# EAGLE design samtec to dsub (EAGLE 7.2.0)
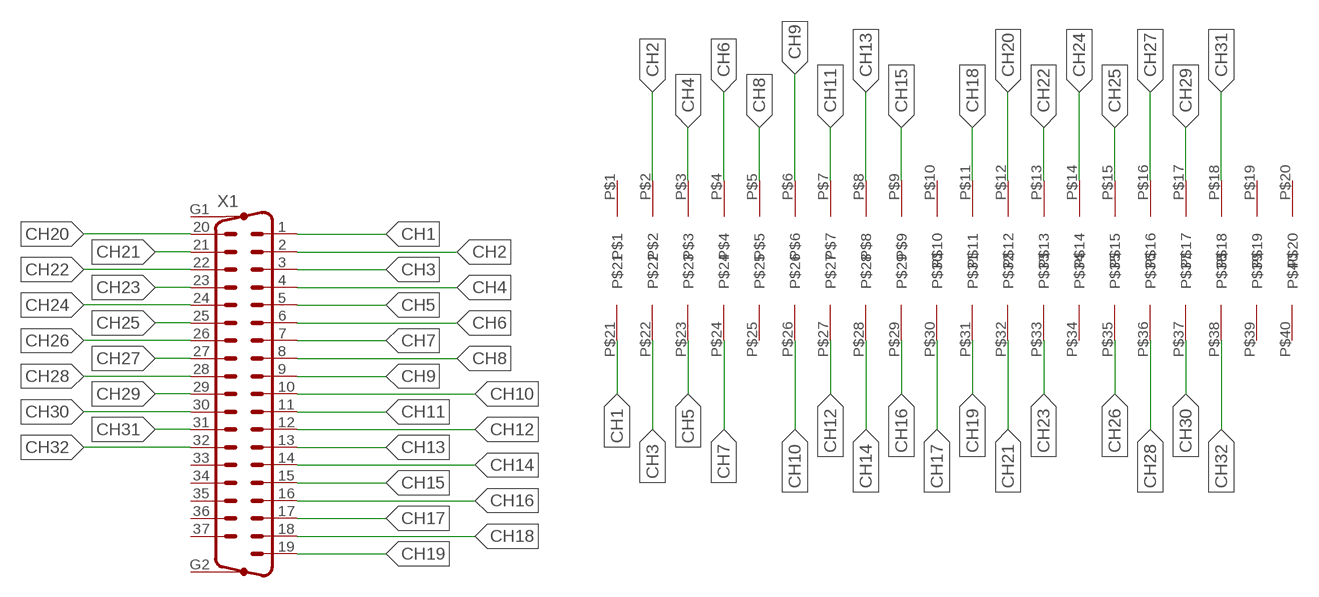
[diagram p0: schematic, sheet 1]

## Parts
U$1  SAMTEC_FTSH_LARGEPAD  [SAMTEC-FTSH-LARGEPAD]
X1  M37HP  [M37HP]

## Nets
CH1: U$1.P$21 X1.1
CH2: U$1.P$2 X1.2
CH3: U$1.P$22 X1.3
CH4: U$1.P$3 X1.4
CH5: U$1.P$23 X1.5
CH6: U$1.P$4 X1.6
CH7: U$1.P$24 X1.7
CH8: U$1.P$5 X1.8
CH9: U$1.P$6 X1.9
CH10: U$1.P$26 X1.10
CH11: U$1.P$7 X1.11
CH12: U$1.P$27 X1.12
CH13: U$1.P$8 X1.13
CH14: U$1.P$28 X1.14
CH15: U$1.P$9 X1.15
CH16: U$1.P$29 X1.16
CH17: U$1.P$30 X1.17
CH18: U$1.P$11 X1.18
CH19: U$1.P$31 X1.19
CH20: U$1.P$12 X1.20
CH21: U$1.P$32 X1.21
CH22: U$1.P$13 X1.22
CH23: U$1.P$33 X1.23
CH24: U$1.P$14 X1.24
CH25: U$1.P$15 X1.25
CH26: U$1.P$35 X1.26
CH27: U$1.P$16 X1.27
CH28: U$1.P$36 X1.28
CH29: U$1.P$17 X1.29
CH30: U$1.P$37 X1.30
CH31: U$1.P$18 X1.31
CH32: U$1.P$38 X1.32
Unconnected: U$1.P$1 U$1.P$10 U$1.P$19 U$1.P$20 U$1.P$25 U$1.P$34 U$1.P$39 U$1.P$40 X1.33 X1.34 X1.35 X1.36 X1.37 X1.G1 X1.G2

## Library data of the parts
U$1 = mayo:SAMTEC_FTSH_LARGEPAD
X1 = con-subd:M37HP: SUB-D; OC_FARNELL: unknown; OC_NEWARK: unknown

## Board
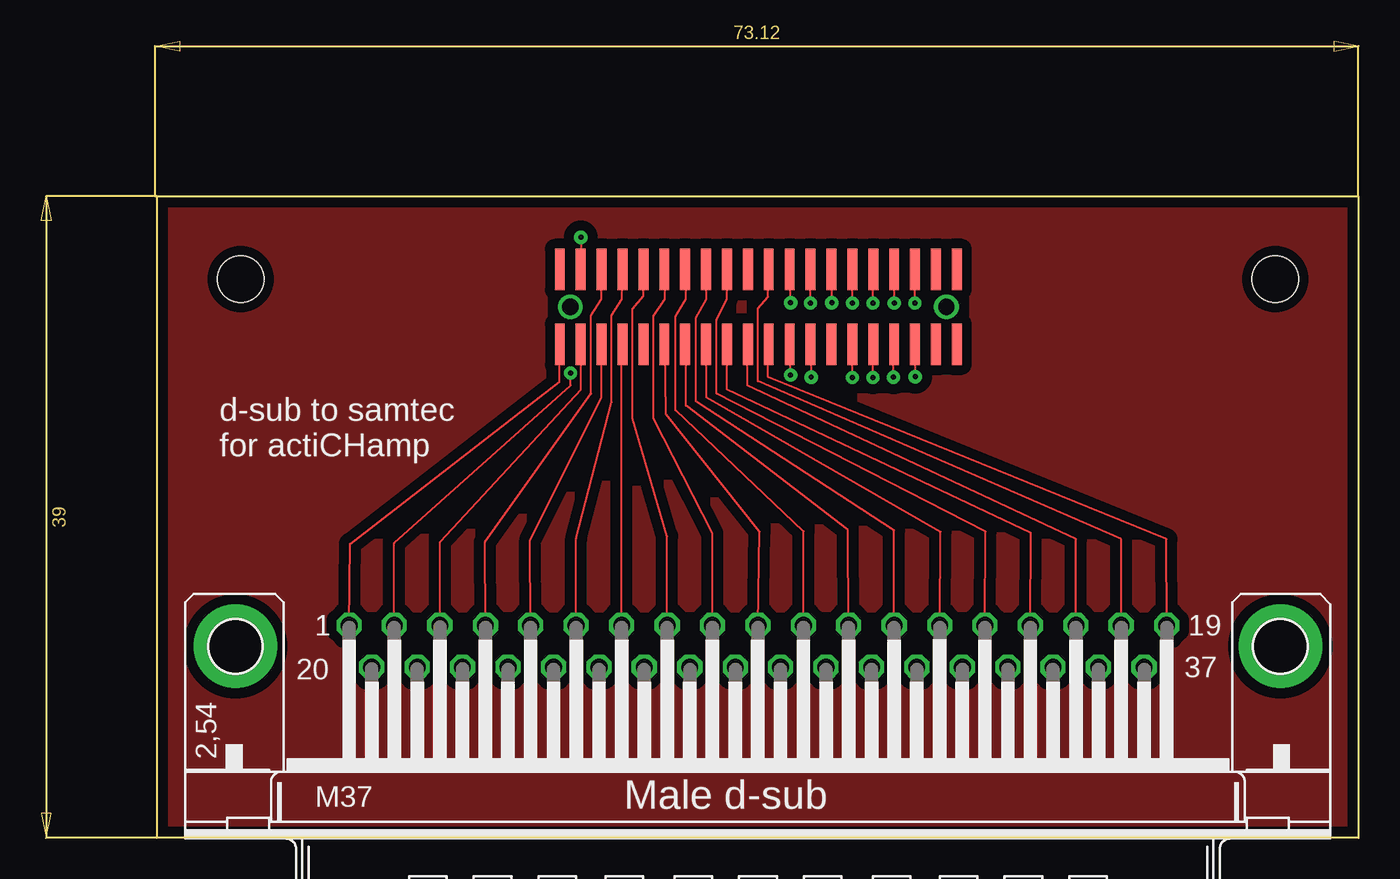
[diagram p1: board, top side]
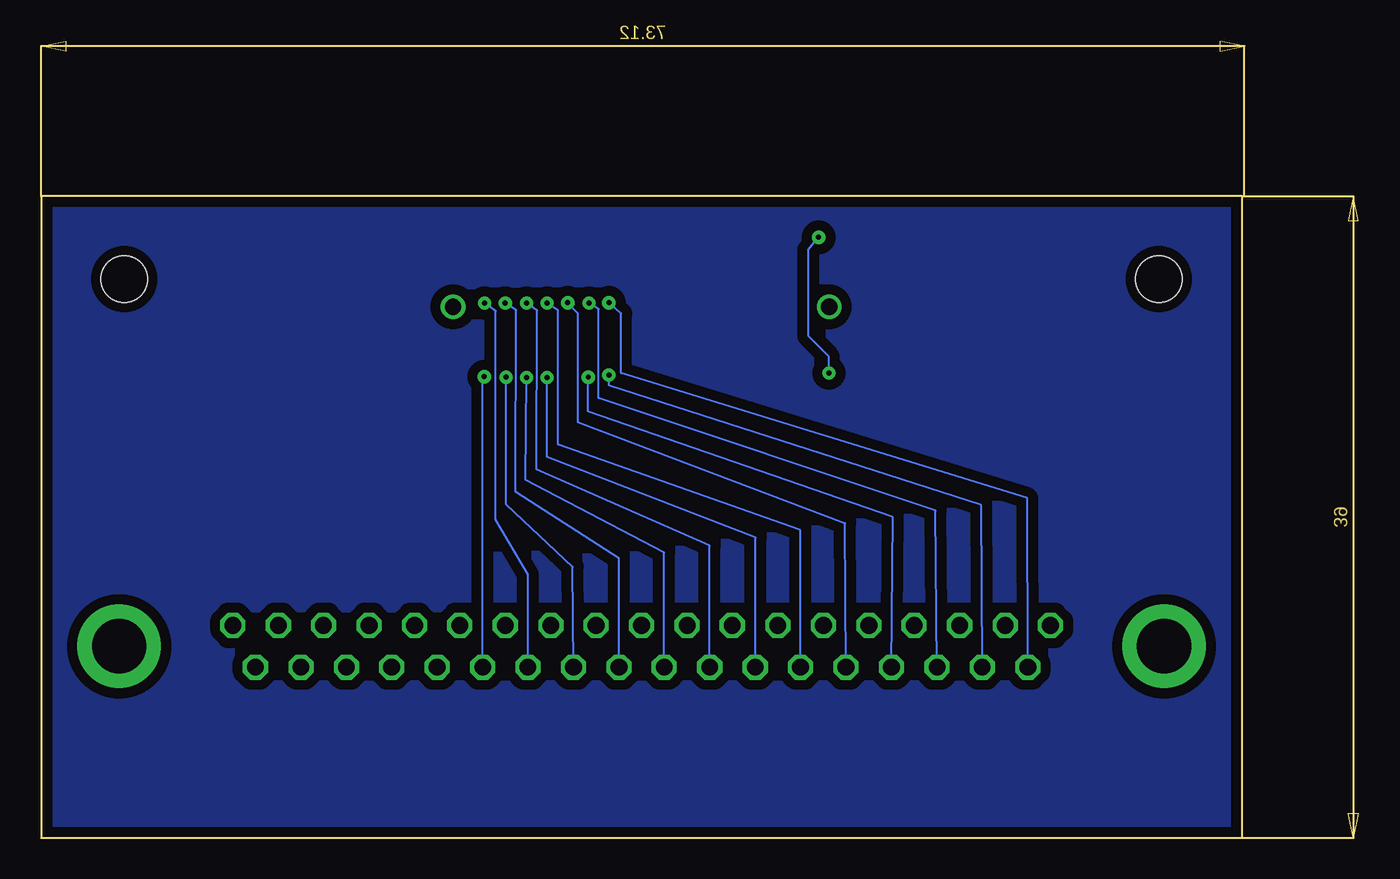
[diagram p2: board, bottom side, seen from below]

Size 73 x 39 mm. Coordinates in mm from the lower left corner, seen from the top.
Outline: 0,0 0,39 73,39 73,0 0,0
Copper layers (1*16): Top 0.035mm / dielectric 1.5mm / Bottom 0.035mm
Design rules "pcbtrain *": minimum track width 5mil, minimum drill 0.3mm, track to track 5mil, track to pad 5mil, pad to pad 5mil, via to via 5mil, smd to smd 0mil, copper to edge 0.25mm, drill to drill 0.2mm, minimum pad ring 10mil, minimum via ring 10mil, stop-mask expansion 5mil, vias tented up to drill 0mil, thermal gap 10mil
Holes 2.8 mm at 5.07,33.95 67.95,33.96

### Footprints (pad centres in the part's own frame; a part is rotated, then mirrored left to right if it is on the bottom)
SAMTEC-FTSH-LARGEPAD = smd 0.6 x 2.5: P$1 -23,7; P$2 -21.73,7; P$3 -20.46,7; P$4 -19.19,7; P$5 -17.92,7; P$6 -16.65,7; P$7 -15.38,7; P$8 -14.11,7; P$9 -12.84,7; P$10 -11.57,7; P$11 -10.3,7; P$12 -9.03,7; P$13 -7.76,7; P$14 -6.49,7; P$15 -5.22,7; P$16 -3.95,7; P$17 -2.68,7; P$18 -1.41,7; P$19 -0.14,7; P$20 1.13,7; P$21 -23,2.45; P$22 -21.73,2.45; P$23 -20.46,2.45; P$24 -19.19,2.45; P$25 -17.92,2.45; P$26 -16.65,2.45; P$27 -15.38,2.45; P$28 -14.11,2.45; P$29 -12.84,2.45; P$30 -11.57,2.45; P$31 -10.3,2.45; P$32 -9.03,2.45; P$33 -7.76,2.45; P$34 -6.49,2.45; P$35 -5.22,2.45; P$36 -3.95,2.45; P$37 -2.68,2.45; P$38 -1.41,2.45; P$39 -0.14,2.45; P$40 1.13,2.45 | drill 1: P$41 -22.365,4.725; P$42 0.495,4.725
M37HP = drill 1.016 octagon: 1 -24.841,1.27; 2 -22.098,1.27; 3 -19.329,1.27; 4 -16.561,1.27; 5 -13.818,1.27; 6 -11.049,1.27; 7 -8.28,1.27; 8 -5.512,1.27; 9 -2.769,1.27; 10 0,1.27; 11 2.769,1.27; 12 5.512,1.27; 13 8.28,1.27; 14 11.049,1.27; 15 13.792,1.27; 16 16.561,1.27; 17 19.329,1.27; 18 22.073,1.27; 19 24.841,1.27; 20 -23.47,-1.27; 21 -20.701,-1.27; 22 -17.958,-1.27; 23 -15.189,-1.27; 24 -12.421,-1.27; 25 -9.652,-1.27; 26 -6.909,-1.27; 27 -4.14,-1.27; 28 -1.372,-1.27; 29 1.372,-1.27; 30 4.14,-1.27; 31 6.909,-1.27; 32 9.652,-1.27; 33 12.421,-1.27; 34 15.189,-1.27; 35 17.932,-1.27; 36 20.701,-1.27; 37 23.47,-1.27 | drill 3.302 pad 5.08: G1 -31.75,0; G2 31.75,0

### Placement (x,y rotation side)
U$1  47.47,27.55 0 top
X1  36.51,11.64 0 top

### Tracks (layer width: path | path; a pad name or v marks a point on that pad's centre or on a via)
CH1
  Top 0.127: X1.1 11.72,17.87 24.45,27.73 24.45,29.98 U$1.P$21
CH2  (via drill 0.3)
  Top 0.127: X1.2 14.41,17.91 25.12,27.5 v25.12,28.25 | v25.75,36.5 U$1.P$2
  Bottom 0.127: v25.12,28.25 25.12,29.25 26.38,30.5 26.38,35.75 v25.75,36.5
CH3
  Top 0.127: X1.3 17.18,17.98 25.75,27.25 U$1.P$22
CH4
  Top 0.127: X1.4 19.92,17.97 26.38,27 26.38,31.75 27,32.75 U$1.P$3
CH5
  Top 0.127: X1.5 22.67,18.12 27,26.75 U$1.P$23
CH6
  Top 0.127: X1.6 25.46,18.19 27.62,26.48 27.62,31.75 28.25,32.75 28.25,34.52 U$1.P$4
CH7
  Top 0.127: X1.7 28.23,29.95 U$1.P$24
CH8
  Top 0.127: X1.8 31,18.33 28.88,25.48 28.88,32.12 29.55,32.92 U$1.P$5
CH9
  Top 0.127: X1.9 33.74,18.51 30.17,25.48 30.17,31.73 30.85,32.75 30.85,34.38 U$1.P$6
CH10
  Top 0.127: X1.10 36.61,18.62 30.92,25.75 30.85,29.97 U$1.P$26
CH11
  Top 0.127: X1.11 39.28,18.62 31.5,26 31.5,31.67 32.12,32.75 32.12,34.52 U$1.P$7
CH12
  Top 0.127: X1.12 41.97,18.7 32.12,26.27 32.12,30.03 U$1.P$27
CH13
  Top 0.127: X1.13 44.79,18.69 32.75,26.52 32.75,31.62 33.38,32.75 33.38,34.53 U$1.P$8
CH14
  Top 0.127: X1.14 47.61,18.59 33.38,26.77 33.38,29.98 U$1.P$28
CH15
  Top 0.127: X1.15 50.34,18.61 34,27 34,31.5 34.62,32.75 U$1.P$9
CH16
  Top 0.127: X1.16 53.09,18.53 34.62,27.25 U$1.P$29
CH17
  Top 0.127: X1.17 55.84,18.16 35.88,27.5 35.88,29.98 U$1.P$30
CH18
  Top 0.127: X1.18 58.59,18.16 36.5,27.75 36.5,32.17 37.12,32.88 37.12,34.51 U$1.P$11
CH19
  Top 0.127: X1.19 61.34,18.16 37.12,28 37.12,29.95 U$1.P$31
CH20  (via drill 0.3)
  Top 0.127: 38.38,34.48 U$1.P$12 38.5,34.49 v38.5,32.52
  Bottom 0.127: X1.20 13.07,20.65 37.75,28.25 37.75,31.88 v38.5,32.52
CH21  (via drill 0.3)
  Top 0.127: v38.5,28.12 38.5,29.94 U$1.P$32
  Bottom 0.127: X1.21 15.87,20.22 38.5,27.5 v38.5,28.12
CH22  (via drill 0.3)
  Top 0.127: v39.7,32.5 U$1.P$13
  Bottom 0.127: X1.22 18.65,19.9 39.12,26.73 39.12,32.12 v39.7,32.5
CH23  (via drill 0.3)
  Top 0.127: v39.75,28 39.75,29.96 U$1.P$33
  Bottom 0.127: X1.23 21.24,19.49 39.75,25.92 v39.75,28
CH24  (via drill 0.3)
  Top 0.127: v41,32.52 41,34.53 U$1.P$14
  Bottom 0.127: X1.24 24.15,19.12 40.38,25.25 40.38,31.88 v41,32.52
CH25  (via drill 0.3)
  Top 0.127: v42.25,32.5 U$1.P$15
  Bottom 0.127: X1.25 26.86,18.71 41.58,23.9 41.6,32.05 v42.25,32.5
CH26  (via drill 0.3)
  Top 0.127: v42.25,27.98 U$1.P$35
  Bottom 0.127: X1.26 29.58,18.25 42.25,23.15 v42.25,27.98
CH27  (via drill 0.3)
  Top 0.127: v43.5,32.5 43.5,34.53 U$1.P$16
  Bottom 0.127: X1.27 32.37,17.77 42.9,22.4 42.85,32.05 v43.5,32.5
CH28  (via drill 0.3)
  Top 0.127: v43.5,27.98 43.5,29.98 U$1.P$36
  Bottom 0.127: X1.28 35.14,17.34 43.55,21.75 v43.5,27.98
CH29  (via drill 0.3)
  Top 0.127: v44.8,32.5 U$1.P$17
  Bottom 0.127: X1.29 37.88,16.98 44.17,21.02 44.12,32.08 v44.8,32.5
CH30  (via drill 0.3)
  Top 0.127: v44.75,28 44.75,29.96 U$1.P$37
  Bottom 0.127: X1.30 40.7,16.48 44.75,20.27 v44.75,28
CH31  (via drill 0.3)
  Top 0.127: v46.05,32.5 U$1.P$18
  Bottom 0.127: X1.31 43.42,15.99 45.38,19.35 45.38,32.02 v46.05,32.5
CH32  (via drill 0.3)
  Top 0.127: v46.08,28.02 46.08,29.94 U$1.P$38
  Bottom 0.127: 46.16,27.71 v46.08,28.02 46.16,28.06 X1.32
G
  pour Bottom (isolate 0.61): -0.38,39.12 73.62,39.12 73,-0.38 -0.12,-0.25
N$1
  pour Top (isolate 0.61): -0.12,39 73.25,39.12 73,-0.25 0,-0.12

### Text on the board
tPlace: Male d-sub
tNames: d-sub to samtec / for actiCHamp